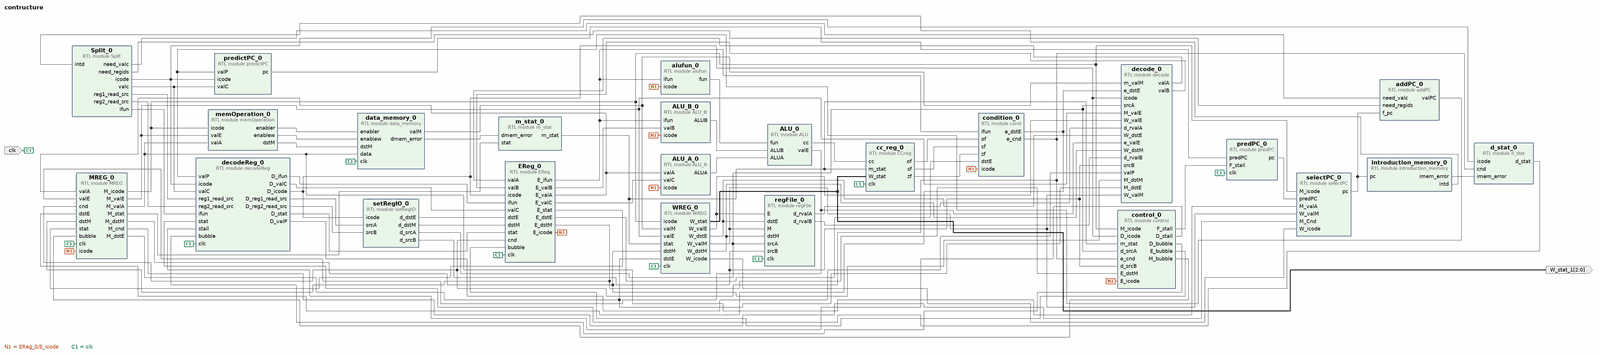
[diagram p0: block diagram of the top level, whole]
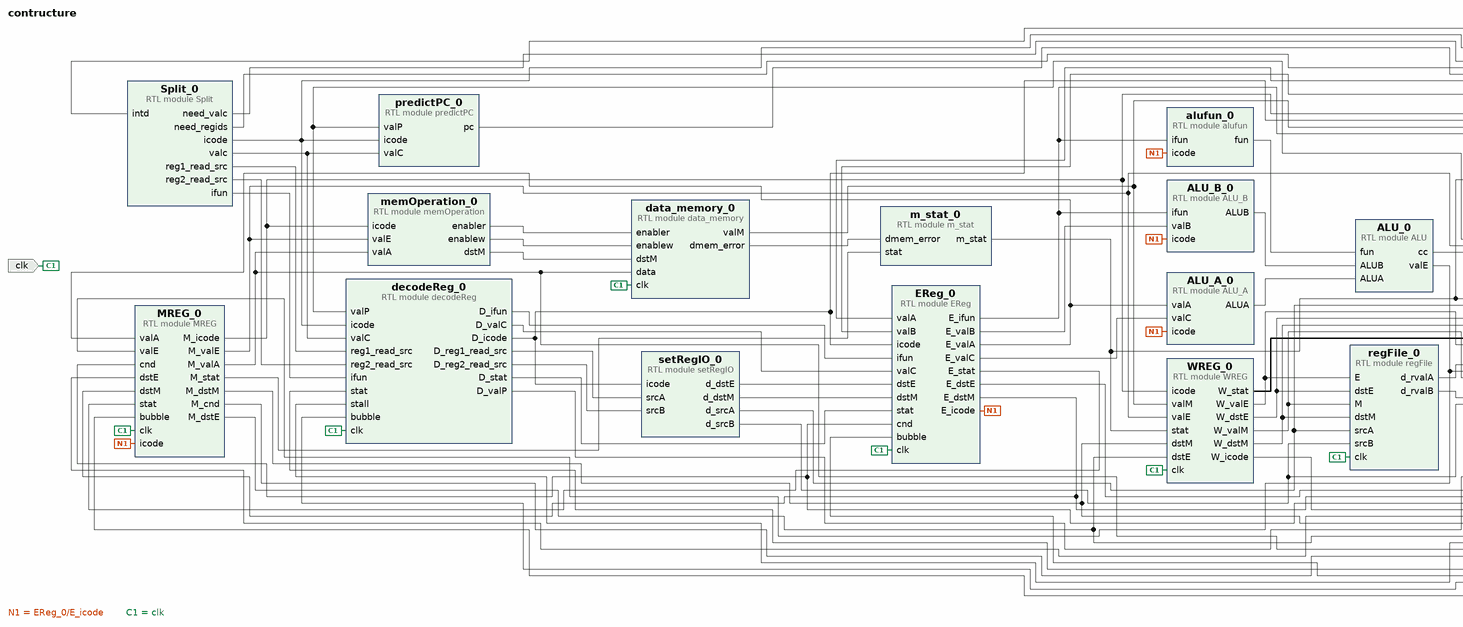
[diagram p1: block diagram of the top level, left part]
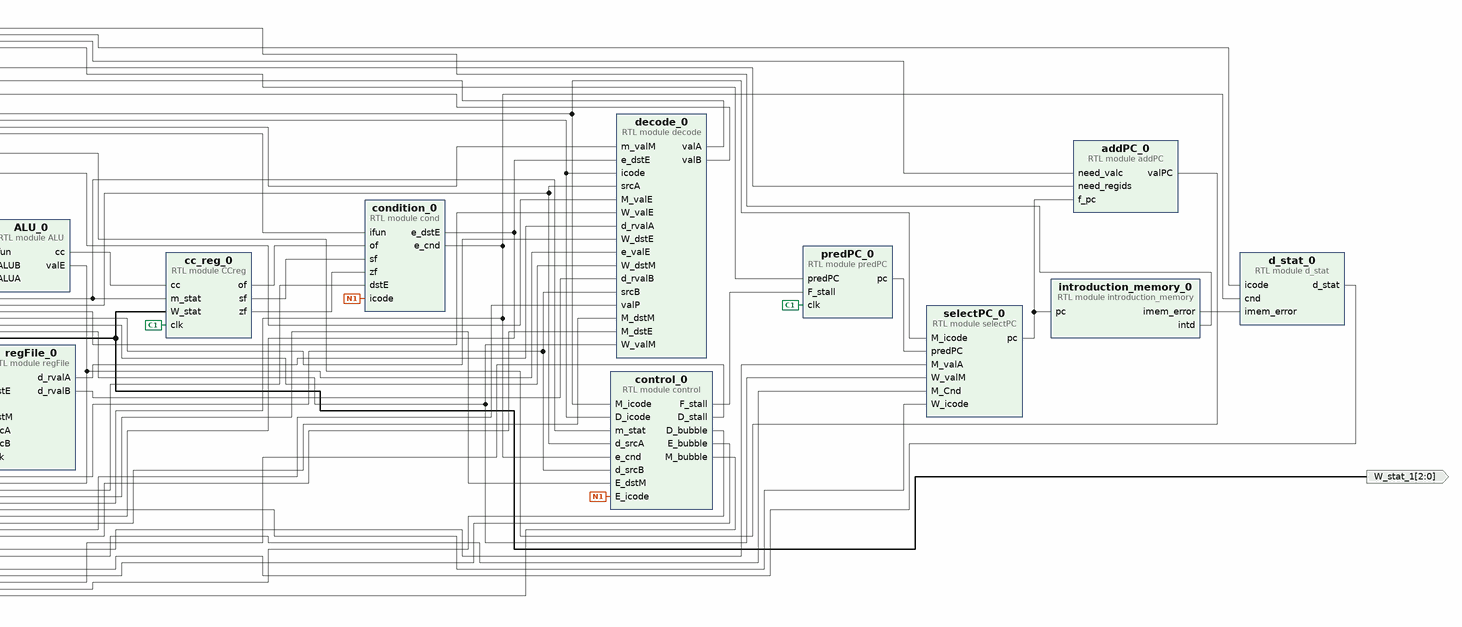
[diagram p2: block diagram of the top level, right part]
# Vivado block design contructure, xc7a15tcsg324-3, Vivado 2017.1
create_bd_design contructure

create_bd_port -dir I -type clk clk
create_bd_port -dir O -from 2 -to 0 W_stat_1

create_bd_cell -type module -reference predPC predPC_0
create_bd_cell -type module -reference selectPC selectPC_0
create_bd_cell -type module -reference introduction_memory introduction_memory_0
create_bd_cell -type module -reference predictPC predictPC_0
create_bd_cell -type module -reference Split Split_0
create_bd_cell -type module -reference decodeReg decodeReg_0
create_bd_cell -type module -reference regFile regFile_0
create_bd_cell -type module -reference addPC addPC_0
create_bd_cell -type module -reference setRegIO setRegIO_0
create_bd_cell -type module -reference decode decode_0
create_bd_cell -type module -reference EReg EReg_0
create_bd_cell -type module -reference ALU_A ALU_A_0
create_bd_cell -type module -reference ALU_B ALU_B_0
create_bd_cell -type module -reference ALU ALU_0
create_bd_cell -type module -reference alufun alufun_0
create_bd_cell -type module -reference MREG MREG_0
create_bd_cell -type module -reference cond condition_0
create_bd_cell -type module -reference WREG WREG_0
create_bd_cell -type module -reference memOperation memOperation_0
create_bd_cell -type module -reference data_memory data_memory_0
create_bd_cell -type module -reference CCreg cc_reg_0
create_bd_cell -type module -reference d_stat d_stat_0
create_bd_cell -type module -reference m_stat m_stat_0
create_bd_cell -type module -reference control control_0

# ---- connections ----

connect_bd_net [get_bd_pins predictPC_0/pc] [get_bd_pins predPC_0/predPC]
connect_bd_net [get_bd_pins predPC_0/pc] [get_bd_pins selectPC_0/predPC]
connect_bd_net [get_bd_pins selectPC_0/pc] [get_bd_pins introduction_memory_0/pc] [get_bd_pins addPC_0/f_pc]
connect_bd_net [get_bd_pins introduction_memory_0/intd] [get_bd_pins Split_0/intd]
connect_bd_net [get_bd_pins Split_0/reg1_read_src] [get_bd_pins decodeReg_0/reg1_read_src]
connect_bd_net [get_bd_pins Split_0/reg2_read_src] [get_bd_pins decodeReg_0/reg2_read_src]
connect_bd_net [get_bd_pins Split_0/icode] [get_bd_pins predictPC_0/icode] [get_bd_pins decodeReg_0/icode] [get_bd_pins d_stat_0/icode]
connect_bd_net [get_bd_pins Split_0/ifun] [get_bd_pins decodeReg_0/ifun]
connect_bd_net [get_bd_pins Split_0/valc] [get_bd_pins predictPC_0/valC] [get_bd_pins decodeReg_0/valC]
connect_bd_net [get_bd_pins Split_0/need_valc] [get_bd_pins addPC_0/need_valc]
connect_bd_net [get_bd_pins Split_0/need_regids] [get_bd_pins addPC_0/need_regids]
connect_bd_net [get_bd_pins addPC_0/valPC] [get_bd_pins predictPC_0/valP] [get_bd_pins decodeReg_0/valP]
connect_bd_net [get_bd_pins decodeReg_0/D_reg1_read_src] [get_bd_pins setRegIO_0/srcA]
connect_bd_net [get_bd_pins decodeReg_0/D_reg2_read_src] [get_bd_pins setRegIO_0/srcB]
connect_bd_net [get_bd_pins decodeReg_0/D_icode] \
  [get_bd_pins setRegIO_0/icode] [get_bd_pins decode_0/icode] [get_bd_pins EReg_0/icode] [get_bd_pins control_0/D_icode]
connect_bd_net [get_bd_pins setRegIO_0/d_srcA] [get_bd_pins regFile_0/srcA] [get_bd_pins decode_0/srcA] [get_bd_pins control_0/d_srcA]
connect_bd_net [get_bd_pins setRegIO_0/d_srcB] [get_bd_pins regFile_0/srcB] [get_bd_pins decode_0/srcB] [get_bd_pins control_0/d_srcB]
connect_bd_net [get_bd_pins decodeReg_0/D_valP] [get_bd_pins decode_0/valP]
connect_bd_net [get_bd_pins regFile_0/d_rvalA] [get_bd_pins decode_0/d_rvalA]
connect_bd_net [get_bd_pins regFile_0/d_rvalB] [get_bd_pins decode_0/d_rvalB]
connect_bd_net [get_bd_pins decodeReg_0/D_ifun] [get_bd_pins EReg_0/ifun]
connect_bd_net [get_bd_pins decode_0/valA] [get_bd_pins EReg_0/valA]
connect_bd_net [get_bd_pins decode_0/valB] [get_bd_pins EReg_0/valB]
connect_bd_net [get_bd_pins decodeReg_0/D_valC] [get_bd_pins EReg_0/valC]
connect_bd_net [get_bd_pins setRegIO_0/d_dstE] [get_bd_pins EReg_0/dstE]
connect_bd_net [get_bd_pins setRegIO_0/d_dstM] [get_bd_pins EReg_0/dstM]
connect_bd_net [get_bd_pins EReg_0/E_icode] \
  [get_bd_pins ALU_A_0/icode] [get_bd_pins ALU_B_0/icode] [get_bd_pins alufun_0/icode] [get_bd_pins MREG_0/icode] \
  [get_bd_pins condition_0/icode] [get_bd_pins control_0/E_icode]
connect_bd_net [get_bd_pins EReg_0/E_ifun] [get_bd_pins ALU_B_0/ifun] [get_bd_pins alufun_0/ifun] [get_bd_pins condition_0/ifun]
connect_bd_net [get_bd_pins EReg_0/E_valB] [get_bd_pins ALU_B_0/valB]
connect_bd_net [get_bd_pins EReg_0/E_valA] [get_bd_pins ALU_A_0/valA] [get_bd_pins MREG_0/valA]
connect_bd_net [get_bd_pins EReg_0/E_valC] [get_bd_pins ALU_A_0/valC]
connect_bd_net [get_bd_pins ALU_A_0/ALUA] [get_bd_pins ALU_0/ALUA]
connect_bd_net [get_bd_pins ALU_B_0/ALUB] [get_bd_pins ALU_0/ALUB]
connect_bd_net [get_bd_pins alufun_0/fun] [get_bd_pins ALU_0/fun]
connect_bd_net [get_bd_pins ALU_0/valE] [get_bd_pins decode_0/e_valE] [get_bd_pins MREG_0/valE]
connect_bd_net [get_bd_pins EReg_0/E_dstE] [get_bd_pins condition_0/dstE]
connect_bd_net -net cond_0_e_dstE [get_bd_pins condition_0/e_dstE] [get_bd_pins decode_0/e_dstE] [get_bd_pins MREG_0/dstE]
connect_bd_net -net cond_0_e_cnd [get_bd_pins condition_0/e_cnd] \
  [get_bd_pins EReg_0/cnd] [get_bd_pins MREG_0/cnd] [get_bd_pins d_stat_0/cnd] [get_bd_pins control_0/e_cnd]
connect_bd_net [get_bd_pins EReg_0/E_dstM] [get_bd_pins MREG_0/dstM] [get_bd_pins control_0/E_dstM]
connect_bd_net [get_bd_pins MREG_0/M_icode] \
  [get_bd_pins selectPC_0/M_icode] [get_bd_pins WREG_0/icode] [get_bd_pins memOperation_0/icode] \
  [get_bd_pins control_0/M_icode]
connect_bd_net [get_bd_pins MREG_0/M_valE] [get_bd_pins decode_0/M_valE] [get_bd_pins WREG_0/valE] [get_bd_pins memOperation_0/valE]
connect_bd_net [get_bd_pins MREG_0/M_valA] [get_bd_pins selectPC_0/M_valA] [get_bd_pins memOperation_0/valA] [get_bd_pins data_memory_0/data]
connect_bd_net [get_bd_pins memOperation_0/enabler] [get_bd_pins data_memory_0/enabler]
connect_bd_net [get_bd_pins memOperation_0/enablew] [get_bd_pins data_memory_0/enablew]
connect_bd_net [get_bd_pins memOperation_0/dstM] [get_bd_pins data_memory_0/dstM]
connect_bd_net [get_bd_pins data_memory_0/valM] [get_bd_pins decode_0/m_valM] [get_bd_pins WREG_0/valM]
connect_bd_net [get_bd_pins MREG_0/M_dstM] [get_bd_pins decode_0/M_dstM] [get_bd_pins WREG_0/dstM]
connect_bd_net [get_bd_pins WREG_0/W_valE] [get_bd_pins regFile_0/E] [get_bd_pins decode_0/W_valE]
connect_bd_net [get_bd_pins WREG_0/W_valM] [get_bd_pins selectPC_0/W_valM] [get_bd_pins regFile_0/M] [get_bd_pins decode_0/W_valM]
connect_bd_net [get_bd_pins WREG_0/W_dstE] [get_bd_pins regFile_0/dstE] [get_bd_pins decode_0/W_dstE]
connect_bd_net [get_bd_pins WREG_0/W_dstM] [get_bd_pins regFile_0/dstM] [get_bd_pins decode_0/W_dstM]
connect_bd_net [get_bd_pins MREG_0/M_cnd] [get_bd_pins selectPC_0/M_Cnd]
connect_bd_net [get_bd_pins WREG_0/W_icode] [get_bd_pins selectPC_0/W_icode]
connect_bd_net [get_bd_ports clk] \
  [get_bd_pins predPC_0/clk] [get_bd_pins decodeReg_0/clk] [get_bd_pins regFile_0/clk] [get_bd_pins EReg_0/clk] \
  [get_bd_pins MREG_0/clk] [get_bd_pins WREG_0/clk] [get_bd_pins data_memory_0/clk] [get_bd_pins cc_reg_0/clk]
connect_bd_net [get_bd_pins WREG_0/W_stat] [get_bd_ports W_stat_1] [get_bd_pins cc_reg_0/W_stat]
connect_bd_net [get_bd_pins decodeReg_0/D_stat] [get_bd_pins EReg_0/stat]
connect_bd_net [get_bd_pins EReg_0/E_stat] [get_bd_pins MREG_0/stat]
connect_bd_net [get_bd_pins MREG_0/M_dstE] [get_bd_pins decode_0/M_dstE] [get_bd_pins WREG_0/dstE]
connect_bd_net [get_bd_pins ALU_0/cc] [get_bd_pins cc_reg_0/cc]
connect_bd_net -net CCreg_0_of [get_bd_pins cc_reg_0/of] [get_bd_pins condition_0/of]
connect_bd_net -net CCreg_0_sf [get_bd_pins cc_reg_0/sf] [get_bd_pins condition_0/sf]
connect_bd_net -net CCreg_0_zf [get_bd_pins cc_reg_0/zf] [get_bd_pins condition_0/zf]
connect_bd_net [get_bd_pins d_stat_0/d_stat] [get_bd_pins decodeReg_0/stat]
connect_bd_net [get_bd_pins introduction_memory_0/imem_error] [get_bd_pins d_stat_0/imem_error]
connect_bd_net [get_bd_pins m_stat_0/m_stat] [get_bd_pins WREG_0/stat] [get_bd_pins cc_reg_0/m_stat] [get_bd_pins control_0/m_stat]
connect_bd_net [get_bd_pins data_memory_0/dmem_error] [get_bd_pins m_stat_0/dmem_error]
connect_bd_net [get_bd_pins control_0/F_stall] [get_bd_pins predPC_0/F_stall]
connect_bd_net [get_bd_pins control_0/D_stall] [get_bd_pins decodeReg_0/stall]
connect_bd_net [get_bd_pins control_0/D_bubble] [get_bd_pins decodeReg_0/bubble]
connect_bd_net [get_bd_pins control_0/E_bubble] [get_bd_pins EReg_0/bubble]
connect_bd_net [get_bd_pins control_0/M_bubble] [get_bd_pins MREG_0/bubble]
connect_bd_net [get_bd_pins MREG_0/M_stat] [get_bd_pins m_stat_0/stat]

validate_bd_design
save_bd_design
